# Altium schematic sheet TIvaC.SchDoc
size Letter; Author: Ángel O., Victor V.; DocumentNumber: 6; Revision: 1.0; SheetNumber: 6; SheetTotal: 6
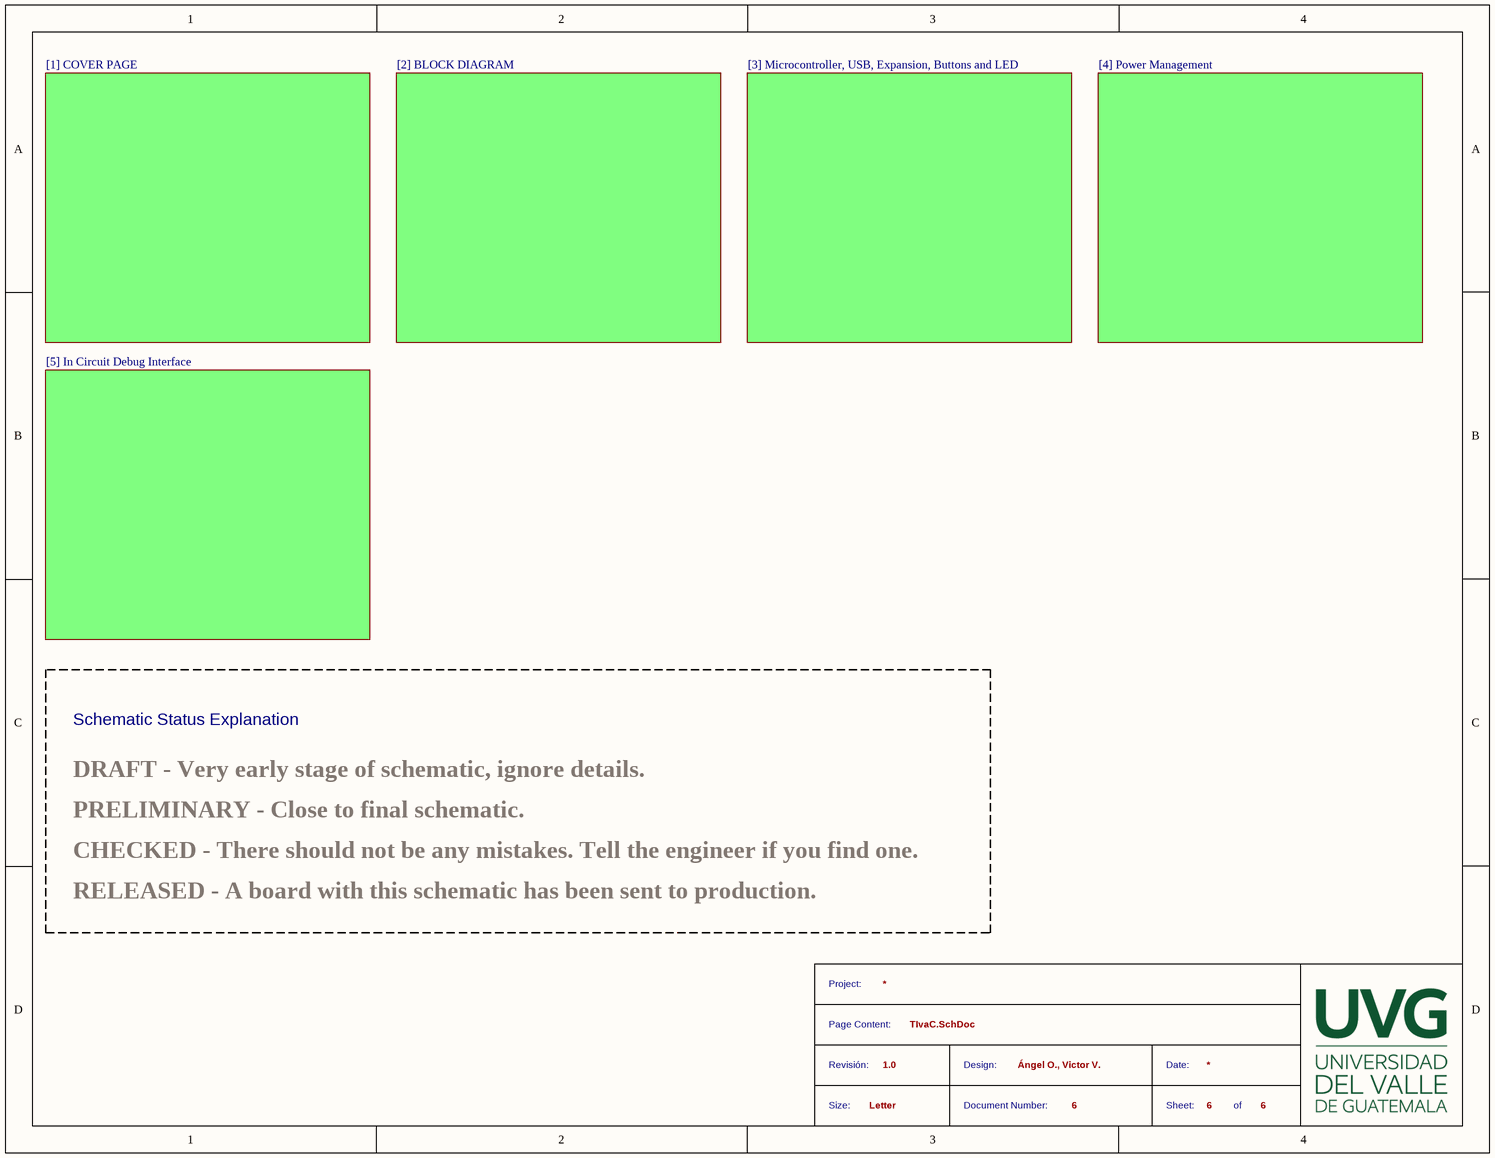
[diagram p0: TIvaC.SchDoc]

## Sub-sheets
Designator = [1] COVER PAGE: no entries
Designator = [2] BLOCK DIAGRAM: no entries
Designator = [3] Microcontroller, USB, Expansion, Buttons and LED: no entries
Designator = [4] Power Management: no entries
Designator = [5] In Circuit Debug Interface: no entries

## Notes on the sheet
- Schematic Status Explanation
- PRELIMINARY - Close to final schematic.
- DRAFT - Very early stage of schematic, ignore details.
- RELEASED - A board with this schematic has been sent to production.
- CHECKED - There should not be any mistakes. Tell the engineer if you find one.
- Project:
- Page Content:
- Revisión:
- Size:
- Letter
- Design:
- Document Number:
- Date:
- Sheet:
- of